# EAGLE schematic sop-dip-16 (EAGLE 4.16)
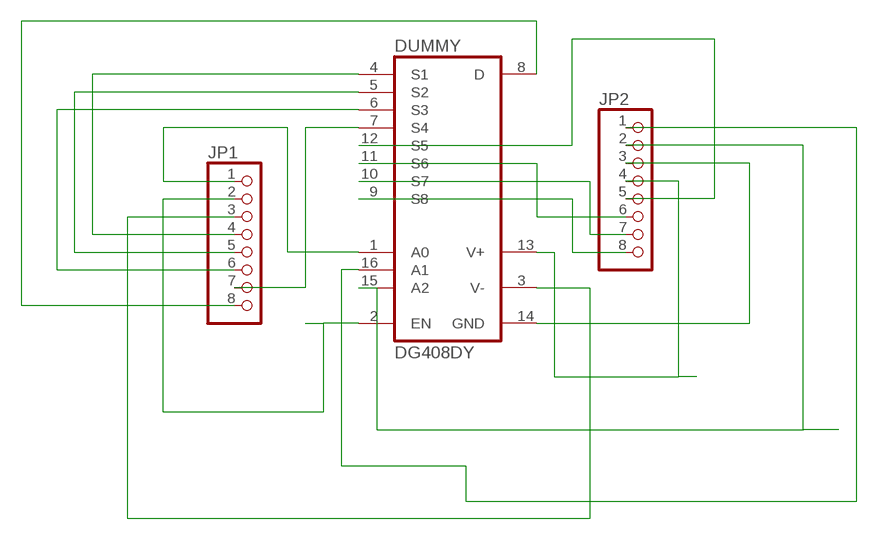
[diagram p0: schematic, sheet 1]

## Parts
DUMMY  DG408DY  [SO16]
JP1  PINHD-1X8  [1X08]
JP2  PINHD-1X8  [1X08]

## Nets
N$1: DUMMY.1(A0) JP1.1
N$2: DUMMY.2(EN) JP1.2
N$3: DUMMY.3(V-) JP1.3
N$4: DUMMY.4(S1) JP1.4
N$5: DUMMY.5(S2) JP1.5
N$6: DUMMY.6(S3) JP1.6
N$7: DUMMY.7(S4) JP1.7
N$8: DUMMY.8(D) JP1.8
N$9: DUMMY.9(S8) JP2.8
N$10: DUMMY.10(S7) JP2.7
N$11: DUMMY.11(S6) JP2.6
N$12: DUMMY.12(S5) JP2.5
N$13: DUMMY.13(V+) JP2.4
N$14: DUMMY.14(GND) JP2.3
N$15: DUMMY.15(A2) JP2.2
N$16: DUMMY.16(A1) JP2.1

## Library data of the parts
DUMMY = maxim-9:DG408DY: ANALOG MULTIPLEXER
JP1 JP2 = pinhead:PINHD-1X8: PIN HEADER